# Altium schematic sheet IMX8_eMMC.SchDoc
size 594 x 420 mm; SheetNumber: 12; SheetTotal: 20
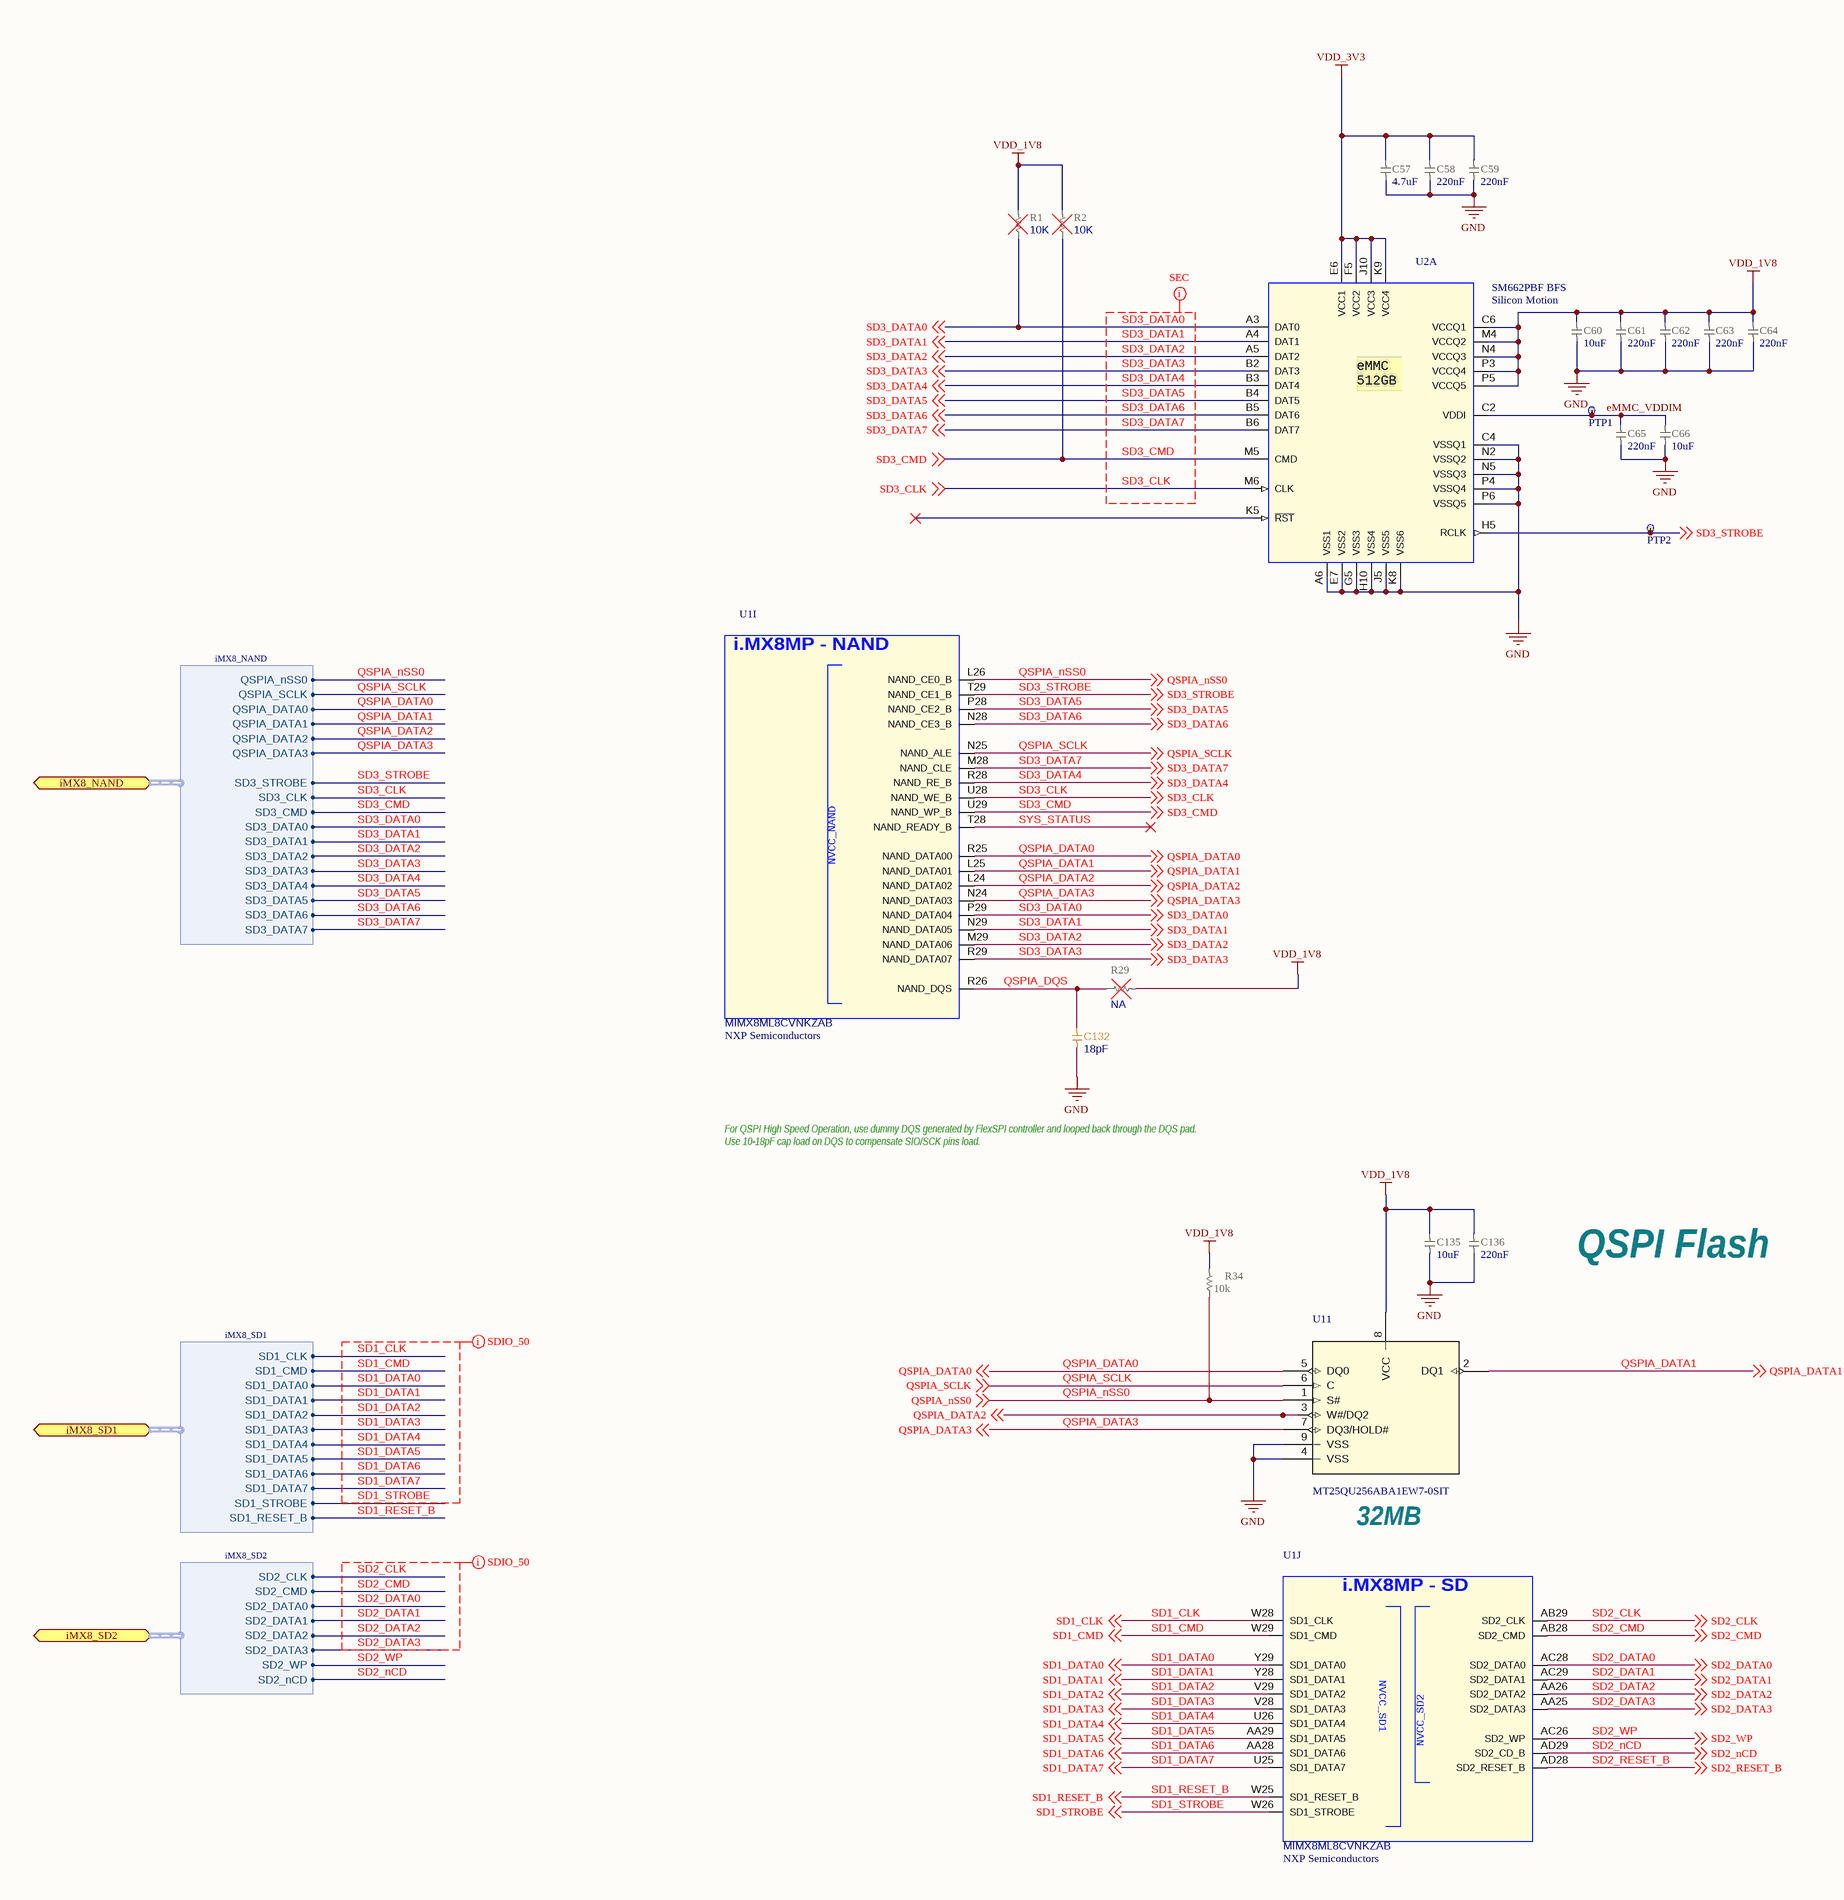
[diagram p0: IMX8_eMMC.SchDoc, left]
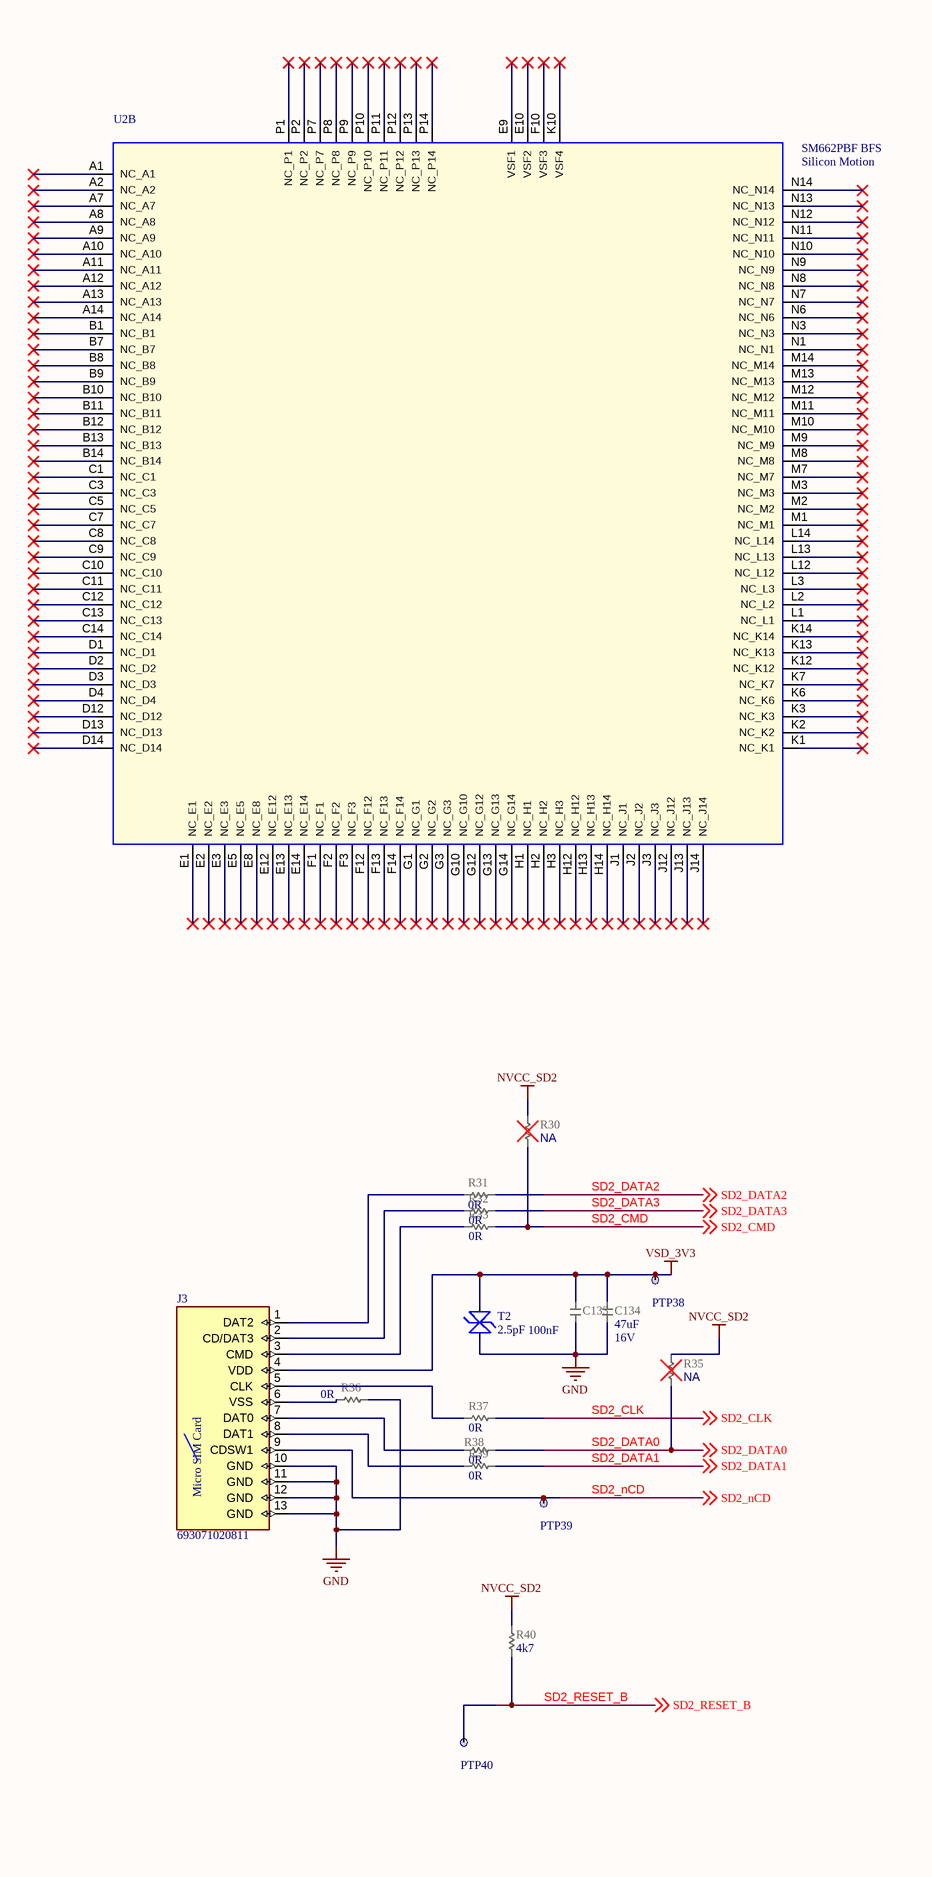
[diagram p1: IMX8_eMMC.SchDoc, right]

## Parts
C57  value 4.7uF  [CAP_0402_H09W07_UN1Q]  (hidden comment: CAP_0402_4u7_10V_X6S)
C58  value 220nF  [CAP_0201_UN1Q]  (hidden comment: CAP_0201_220n_10V_X6S)
C59  value 220nF  [CAP_0201_UN1Q]  (hidden comment: CAP_0201_220n_10V_X6S)
C60  value 10uF  [CAP_0402_H09W07_UN1Q]  (hidden comment: CAP_0402_10u_X6S)
C61  value 220nF  [CAP_0201_UN1Q]  (hidden comment: CAP_0201_220n_10V_X6S)
C62  value 220nF  [CAP_0201_UN1Q]  (hidden comment: CAP_0201_220n_10V_X6S)
C63  value 220nF  [CAP_0201_UN1Q]  (hidden comment: CAP_0201_220n_10V_X6S)
C64  value 220nF  [CAP_0201_UN1Q]  (hidden comment: CAP_0201_220n_10V_X6S)
C65  value 220nF  [CAP_0201_UN1Q]  (hidden comment: CAP_0201_220n_10V_X6S)
C66  value 10uF  [CAP_0402_H09W07_UN1Q]  (hidden comment: CAP_0402_10u_X6S)
C132  value 18pF  [CAP_0201_UN1Q]  (hidden comment: CAP_0201_18p_RF_MATCHING)
C133  value 100nF  [CAP_0201_UN1Q]  (hidden comment: CAP_0201_100n_X7S_16V)
C134  value 47uF  Voltage: 16V  [CAP_1210_UN1Q_1]  (hidden comment: CAP_1210_47uF_16V_X6S)
C135  value 10uF  [CAP_0402_H09W07_UN1Q]  (hidden comment: CAP_0402_10u_X6S)
C136  value 220nF  [CAP_0201_UN1Q]  (hidden comment: CAP_0201_220n_10V_X6S)
J3  693071020811  [693071020811]
PTP1  PTP_0.4mm  [PTP_0.4mm]  (value not drawn)  (no BOM)
PTP2  PTP_0.4mm  [PTP_0.4mm]  (value not drawn)  (no BOM)
PTP38  PTP_0.4mm  [PTP_0.4mm]  (value not drawn)  (no BOM)
PTP39  PTP_0.4mm  [PTP_0.4mm]  (value not drawn)  (no BOM)
PTP40  PTP_0.4mm  [PTP_0.4mm]  (value not drawn)  (no BOM)
R1  value 10K  [RES_0201_UN1Q]  (hidden comment: RES_0201_NA)
R2  value 10K  [RES_0201_UN1Q]  (hidden comment: RES_0201_NA)
R29  value NA  [RES_0201_UN1Q]  (hidden comment: RES_0201_NA)
R30  value NA  [RES_0201_UN1Q]  (hidden comment: RES_0201_NA)
R31  value 0R  [RES_0201_UN1Q]  (hidden comment: RES_0201_0R)
R32  value 0R  [RES_0201_UN1Q]  (hidden comment: RES_0201_0R)
R33  value 0R  [RES_0201_UN1Q]  (hidden comment: RES_0201_0R)
R34  10k  [RES_0201_UN1Q]
R35  value NA  [RES_0201_UN1Q]  (hidden comment: RES_0201_NA)
R36  value 0R  [RES_0201_UN1Q]  (hidden comment: RES_0201_0R)
R37  value 0R  [RES_0201_UN1Q]  (hidden comment: RES_0201_0R)
R38  value 0R  [RES_0201_UN1Q]  (hidden comment: RES_0201_0R)
R39  value 0R  [RES_0201_UN1Q]  (hidden comment: RES_0201_0R)
R40  value 4k7  [RES_0201_UN1Q]  (hidden comment: RES_0201_4k7)
T2  value 2.5pF  [TVS_0201_EZAEG]  (hidden comment: TVS_0201_2.5pF_5V)
U1  Manufacturer: NXP Semiconductors  [BGA548C50P29X29_1500X1500X148]  (hidden comment: MIMX8ML8CVNKZAB)  (parts I,J of 15)
U2  Manufacturer: Silicon Motion  [GA153C50P14X14_1150X1300X120]  (hidden comment: SM662PBF BFS)  (parts A,B of 2)
U11  MT25QU256ABA1EW7-0SIT  [W-PDFN-8MLP8_W7_MRN]

## Ports
iMX8_NAND (bidir, harness iMX8_NAND), iMX8_SD1 (bidir, harness iMX8_SD1), iMX8_SD2 (bidir, harness iMX8_SD2)

## Harnesses
iMX8_SD1: SD1_CLK, SD1_CMD, SD1_DATA0, SD1_DATA1, SD1_DATA2, SD1_DATA3, SD1_DATA4, SD1_DATA5, SD1_DATA6, SD1_DATA7, SD1_RESET_B, SD1_STROBE
iMX8_SD2: SD2_CLK, SD2_CMD, SD2_DATA0, SD2_DATA1, SD2_DATA2, SD2_DATA3, SD2_WP, SD2_nCD
iMX8_NAND: QSPIA_SCLK, QSPIA_DATA0, QSPIA_nSS0, QSPIA_DATA1, QSPIA_DATA2, QSPIA_DATA3, SD3_STROBE, SD3_CLK, SD3_CMD, SD3_DATA0, SD3_DATA1, SD3_DATA2, SD3_DATA3, SD3_DATA4, SD3_DATA5, SD3_DATA6, SD3_DATA7

## Nets
GND: C57.1 C58.1 C59.1 C60.2 C61.1 C62.1 C63.1 C64.1 C65.1 C66.2 C132.1 C133.1 C134.1 C135.2 C136.2 J3.10(GND) J3.11(GND) J3.12(GND) J3.13(GND) R36.2 T2.1 U2.A6(VSS1) U2.C4(VSSQ1) U2.E7(VSS2) U2.G5(VSS3) U2.H10(VSS4) U2.J5(VSS5) U2.K8(VSS6) U2.N2(VSSQ2) U2.N5(VSSQ3) U2.P4(VSSQ4) U2.P6(VSSQ5) U11.4(VSS) U11.9(VSS)
NVCC_SD2: R30.1 R35.1 R40.2
VDD_1V8: C60.1 C61.2 C62.2 C63.2 C64.2 C135.1 C136.1 R1.2 R2.2 R29.2 R34.2 U2.C6(VCCQ1) U2.M4(VCCQ2) U2.N4(VCCQ3) U2.P3(VCCQ4) U2.P5(VCCQ5) U11.8(VCC)
VDD_3V3: C57.2 C58.2 C59.2 U2.E6(VCC1) U2.F5(VCC2) U2.J10(VCC3) U2.K9(VCC4)
VSD_3V3: C133.2 C134.2 J3.4(VDD) PTP38.1(TP) T2.2
eMMC_VDDIM: C65.2 C66.1 PTP1.1(TP) U2.C2(VDDI)
QSPIA_DATA0: U1.R25(NAND_DATA00) U11.5(DQ0) ; off-sheet QSPIA_DATA0, port iMX8_NAND.QSPIA_DATA0
QSPIA_DATA1: U1.L25(NAND_DATA01) U11.2(DQ1) ; off-sheet QSPIA_DATA1, port iMX8_NAND.QSPIA_DATA1
QSPIA_DATA2: U1.L24(NAND_DATA02) U11.3(W#/DQ2) ; off-sheet QSPIA_DATA2, port iMX8_NAND.QSPIA_DATA2
QSPIA_DATA3: U1.N24(NAND_DATA03) U11.7(DQ3/HOLD#) ; off-sheet QSPIA_DATA3, port iMX8_NAND.QSPIA_DATA3
QSPIA_DQS: C132.2 R29.1 U1.R26(NAND_DQS)
QSPIA_nSS0: R34.1 U1.L26(NAND_CE0_B) U11.1(S#) ; off-sheet QSPIA_nSS0, port iMX8_NAND.QSPIA_nSS0
QSPIA_SCLK: U1.N25(NAND_ALE) U11.6(C) ; off-sheet QSPIA_SCLK, port iMX8_NAND.QSPIA_SCLK
SD1_CLK: U1.W28(SD1_CLK) ; off-sheet SD1_CLK, port iMX8_SD1.SD1_CLK
SD1_CMD: U1.W29(SD1_CMD) ; off-sheet SD1_CMD, port iMX8_SD1.SD1_CMD
SD1_DATA0: U1.Y29(SD1_DATA0) ; off-sheet SD1_DATA0, port iMX8_SD1.SD1_DATA0
SD1_DATA1: U1.Y28(SD1_DATA1) ; off-sheet SD1_DATA1, port iMX8_SD1.SD1_DATA1
SD1_DATA2: U1.V29(SD1_DATA2) ; off-sheet SD1_DATA2, port iMX8_SD1.SD1_DATA2
SD1_DATA3: U1.V28(SD1_DATA3) ; off-sheet SD1_DATA3, port iMX8_SD1.SD1_DATA3
SD1_DATA4: U1.U26(SD1_DATA4) ; off-sheet SD1_DATA4, port iMX8_SD1.SD1_DATA4
SD1_DATA5: U1.AA29(SD1_DATA5) ; off-sheet SD1_DATA5, port iMX8_SD1.SD1_DATA5
SD1_DATA6: U1.AA28(SD1_DATA6) ; off-sheet SD1_DATA6, port iMX8_SD1.SD1_DATA6
SD1_DATA7: U1.U25(SD1_DATA7) ; off-sheet SD1_DATA7, port iMX8_SD1.SD1_DATA7
SD1_RESET_B: U1.W25(SD1_RESET_B) ; off-sheet SD1_RESET_B, port iMX8_SD1.SD1_RESET_B
SD1_STROBE: U1.W26(SD1_STROBE) ; off-sheet SD1_STROBE, port iMX8_SD1.SD1_STROBE
SD2_CLK: R37.2 U1.AB29(SD2_CLK) ; off-sheet SD2_CLK, port iMX8_SD2.SD2_CLK
SD2_CMD: R30.2 R33.2 U1.AB28(SD2_CMD) ; off-sheet SD2_CMD, port iMX8_SD2.SD2_CMD
SD2_DATA0: R35.2 R38.2 U1.AC28(SD2_DATA0) ; off-sheet SD2_DATA0, port iMX8_SD2.SD2_DATA0
SD2_DATA1: R39.2 U1.AC29(SD2_DATA1) ; off-sheet SD2_DATA1, port iMX8_SD2.SD2_DATA1
SD2_DATA2: R31.1 U1.AA26(SD2_DATA2) ; off-sheet SD2_DATA2, port iMX8_SD2.SD2_DATA2
SD2_DATA3: R32.2 U1.AA25(SD2_DATA3) ; off-sheet SD2_DATA3, port iMX8_SD2.SD2_DATA3
SD2_nCD: J3.9(CDSW1) PTP39.1(TP) U1.AD29(SD2_CD_B) ; off-sheet SD2_nCD, port iMX8_SD2.SD2_nCD
SD2_RESET_B: PTP40.1(TP) R40.1 U1.AD28(SD2_RESET_B) ; off-sheet SD2_RESET_B
SD2_WP: U1.AC26(SD2_WP) ; off-sheet SD2_WP, port iMX8_SD2.SD2_WP
SD3_CLK: U1.U28(NAND_WE_B) U2.M6(CLK) ; off-sheet SD3_CLK, port iMX8_NAND.SD3_CLK
SD3_CMD: R2.1 U1.U29(NAND_WP_B) U2.M5(CMD) ; off-sheet SD3_CMD, port iMX8_NAND.SD3_CMD
SD3_DATA0: R1.1 U1.P29(NAND_DATA04) U2.A3(DAT0) ; off-sheet SD3_DATA0, port iMX8_NAND.SD3_DATA0
SD3_DATA1: U1.N29(NAND_DATA05) U2.A4(DAT1) ; off-sheet SD3_DATA1, port iMX8_NAND.SD3_DATA1
SD3_DATA2: U1.M29(NAND_DATA06) U2.A5(DAT2) ; off-sheet SD3_DATA2, port iMX8_NAND.SD3_DATA2
SD3_DATA3: U1.R29(NAND_DATA07) U2.B2(DAT3) ; off-sheet SD3_DATA3, port iMX8_NAND.SD3_DATA3
SD3_DATA4: U1.R28(NAND_RE_B) U2.B3(DAT4) ; off-sheet SD3_DATA4, port iMX8_NAND.SD3_DATA4
SD3_DATA5: U1.P28(NAND_CE2_B) U2.B4(DAT5) ; off-sheet SD3_DATA5, port iMX8_NAND.SD3_DATA5
SD3_DATA6: U1.N28(NAND_CE3_B) U2.B5(DAT6) ; off-sheet SD3_DATA6, port iMX8_NAND.SD3_DATA6
SD3_DATA7: U1.M28(NAND_CLE) U2.B6(DAT7) ; off-sheet SD3_DATA7, port iMX8_NAND.SD3_DATA7
SD3_STROBE: PTP2.1(TP) U1.T29(NAND_CE1_B) U2.H5(RCLK) ; off-sheet SD3_STROBE, port iMX8_NAND.SD3_STROBE
SYS_STATUS: U1.T28(NAND_READY_B)
NetJ3_1: J3.1(DAT2) R31.2
NetJ3_2: J3.2(CD/DAT3) R32.1
NetJ3_3: J3.3(CMD) R33.1
NetJ3_5: J3.5(CLK) R37.1
NetJ3_6: J3.6(VSS) R36.1
NetJ3_7: J3.7(DAT0) R38.1
NetJ3_8: J3.8(DAT1) R39.1

Not connected (* = marked no-connect by the designer): U2 A1(NC_A1)* A2(NC_A2)* A7(NC_A7)* A8(NC_A8)* A9(NC_A9)* A10(NC_A10)* A11(NC_A11)* A12(NC_A12)* A13(NC_A13)* A14(NC_A14)* B1(NC_B1)* B7(NC_B7)* B8(NC_B8)* B9(NC_B9)* B10(NC_B10)* B11(NC_B11)* B12(NC_B12)* B13(NC_B13)* B14(NC_B14)* C1(NC_C1)* C3(NC_C3)* C5(NC_C5)* C7(NC_C7)* C8(NC_C8)* C9(NC_C9)* C10(NC_C10)* C11(NC_C11)* C12(NC_C12)* C13(NC_C13)* C14(NC_C14)* D1(NC_D1)* D2(NC_D2)* D3(NC_D3)* D4(NC_D4)* D12(NC_D12)* D13(NC_D13)* D14(NC_D14)* E1(NC_E1)* E2(NC_E2)* E3(NC_E3)* E5(NC_E5)* E8(NC_E8)* E9(VSF1)* E10(VSF2)* E12(NC_E12)* E13(NC_E13)* E14(NC_E14)* F1(NC_F1)* F2(NC_F2)* F3(NC_F3)* F10(VSF3)* F12(NC_F12)* F13(NC_F13)* F14(NC_F14)* G1(NC_G1)* G2(NC_G2)* G3(NC_G3)* G10(NC_G10)* G12(NC_G12)* G13(NC_G13)* G14(NC_G14)* H1(NC_H1)* H2(NC_H2)* H3(NC_H3)* H12(NC_H12)* H13(NC_H13)* H14(NC_H14)* J1(NC_J1)* J2(NC_J2)* J3(NC_J3)* J12(NC_J12)* J13(NC_J13)* J14(NC_J14)* K1(NC_K1)* K2(NC_K2)* K3(NC_K3)* K5(~{RST})* K6(NC_K6)* K7(NC_K7)* K10(VSF4)* K12(NC_K12)* K13(NC_K13)* K14(NC_K14)* L1(NC_L1)* L2(NC_L2)* L3(NC_L3)* L12(NC_L12)* L13(NC_L13)* L14(NC_L14)* M1(NC_M1)* M2(NC_M2)* M3(NC_M3)* M7(NC_M7)* M8(NC_M8)* M9(NC_M9)* M10(NC_M10)* M11(NC_M11)* M12(NC_M12)* M13(NC_M13)* M14(NC_M14)* N1(NC_N1)* N3(NC_N3)* N6(NC_N6)* N7(NC_N7)* N8(NC_N8)* N9(NC_N9)* N10(NC_N10)* N11(NC_N11)* N12(NC_N12)* N13(NC_N13)* N14(NC_N14)* P1(NC_P1)* P2(NC_P2)* P7(NC_P7)* P8(NC_P8)* P9(NC_P9)* P10(NC_P10)* P11(NC_P11)* P12(NC_P12)* P13(NC_P13)* P14(NC_P14)*

## Layout directives
net class SEC: SD3_CLK, SD3_CMD, SD3_DATA0, SD3_DATA1, SD3_DATA2, SD3_DATA3, SD3_DATA4, SD3_DATA5, SD3_DATA6, SD3_DATA7
net class SDIO: SD1_CLK, SD1_CMD, SD1_DATA0, SD1_DATA1, SD1_DATA2, SD1_DATA3, SD1_DATA4, SD1_DATA5, SD1_DATA6, SD1_DATA7, SD1_STROBE, SD2_CLK, SD2_CMD, SD2_DATA0, SD2_DATA1, SD2_DATA2, SD2_DATA3

## Notes on the sheet
- For QSPI High Speed Operation, use dummy DQS generated by FlexSPI controller and looped back through the DQS pad.
  Use 10-18pF cap load on DQS to compensate SIO/SCK pins load.
- QSPI Flash
- (near U11) 32MB
- DWG NO:
- REV:
- THIS DOCUMENT AND THE DATA DISCLOSED HEREIN OR
- HEREWITH IS THE PROPERTY OF ALTIUM LIMITED AND MAY
- BE FREELY DISTRIBUTED IN WHOLE. NO RIGHTS ARE
- RESERVED OR EXPRESS OR IMPLIED WARANTEE GIVEN.
- REVISION
- DESCRIPTION
- DATE
- APPROVED
- ENG:
- APPROVALS
- PROJECT
- DSN:
- CHK:
- REFERENCE DOCUMENTS
- PROJECT REVISION:
- TITLE
- DOCUMENT REVISION:
- DESIGN ITEM:
- BOM:
- FAB DWG:
- PCB DWG:
- ASSY DWG:
- SCALE:
- A2
- SIZE
- CAGE CODE
- FILE NAME
- DWG NO.
- SHEET
- OF
- REV
- (in symbol 693071020811) Micro SIM Card
- (in symbol CMP-001-000983-8, part I) i.MX8MP - NAND
- (in symbol CMP-001-000983-8, part J) i.MX8MP - SD
- (in symbol CMP-001-001175-2, part A) eMMC / 512GB

## Library data of the parts
C57 = CMP-001-000888-12: CAP; Part Number: GRT155C81A475ME13J; Manufacturer: Murata; Sort order: 304; HasBeenBuilt: TBD; Alternative component: Allowed; System: RLC; Voltage: 10V; Temperature characteristics: X6S; Tolerance: +/-10%; ComponentLink2Description: 2_Product page; Package: 0402; Creation date: 26042024; ComponentLink1Description: 1_Datasheet; ComponentLink3Description: 3_X-information; ComponentLink4Description: 4_X-information; Manufacturer Part Number: GRT155C81A475ME13J; Component Type: Capacitor
C58 C59 C61-C65 C136 = CMP-001-000889-11: CAP; Part Number: GRM033C81A224KE01D; Manufacturer: Murata; Temperature characteristics: X6S; Voltage: 10V; Tolerance: +/-20%; Sort order: 302; HasBeenBuilt: TBD; Alternative component: Allowed; System: RLC; Package: 0201; Dimensions WxLxH: 0.35; ComponentLink1Description: 1_Datasheet; ComponentLink2Description: 2_Product page; ComponentLink3Description: 3_X-information; ComponentLink4Description: 4_X-information; Creation date: 26042024; ClassName: SMALL; Manufacturer Part Number: GRM033C81A224KE01D; Component Type: Capacitor
C60 C66 C135 = CMP-001-000883-14: CAP; Part Number: GMC04X6S106M6R3NT; Manufacturer: Cal-Chip Electronics, Inc.; Manufacturer: Cal-Chip Electronics; Voltage: 6.3V; Tolerance: +/-20%; Temperature characteristics: X6S; Sort order: 304; HasBeenBuilt: TBD; Alternative component: Allowed; System: RLC; Package: 0402; ComponentLink1Description: 1_Datasheet; ComponentLink2Description: 2_Product page; ComponentLink3Description: 3_X-information; ComponentLink4Description: 4_X-information; Creation date: 26042024; Manufacturer Part Number: GMC04X6S106M6R3NT; Component Type: Capacitor
C132 = CMP-001-000400-12: CAP_RF_MATCHING; Part Number: GJM0335C1E180JB01; Manufacturer: Murata; Voltage: 25V; Tolerance: +/-2%; Temperature characteristics: C0G; Remark: RF matching, use part number; Sort order: 202; HasBeenBuilt: TBD; System: RLC; Package: 0201; ClassName: SMALL; ComponentLink1Description: 1_Datasheet; ComponentLink2Description: 2_Product page; ComponentLink3Description: 3_X-information; ComponentLink4Description: 4_X-information; Creation date: 20200101; Source: RLC_UN1Q.SchLib; Manufacturer Part Number: GJM0335C1E180JB01; Component Type: Capacitor
C133 = CMP-001-000385-16: CAP; Part Number: GRM033C71C104KE14D; Manufacturer: Murata; Temperature characteristics: X7S; Tolerance: +/-10%; Sort order: 302; HasBeenBuilt: TBD; Alternative component: Allowed; Voltage: 16V; System: RLC; Package: 0201; ClassName: SMALL; ComponentLink1Description: 1_Datasheet; ComponentLink2Description: 2_Product page; ComponentLink3Description: 3_X-information; ComponentLink4Description: 4_X-information; Creation date: 20190101; Source: RLC_UN1Q.SchLib; Manufacturer Part Number: GRM033C71C104KE14D; Component Type: Capacitor
C134 = CMP-001-001071-3: CAP; Part Number: GRM32EC81C476KE15K; Manufacturer: Murata; Temperature characteristics: X6S; Tolerance: ±10%; Sort order: 304; HasBeenBuilt: no; Alternative component: Allowed; System: RLC; Package: 1210; Operating temperature range: -55 ... +105 °C; Dimensions WxLxH: 2.5 x 3.2 x 2.5; ComponentLink1Description: 2_Product_page; ComponentLink2Description: 2_Product page; ComponentLink3Description: 3_X-information; ComponentLink4Description: 4_X-information; Creation date: 20250214; ECCN: EAR99; RoHS: RoHS3; Manufacturer Part Number: GRM32EC81C476KE15K; Component Type: Capacitor
J3 = 693071020811: MF: {'manufacturer': u'W\xfcrth Elektronik'}; Package: None; Price: None; Value: *; MP: 693071020811; Availability: Unavailable
PTP1 PTP2 PTP38-PTP40 = CMP-001-001296-3: Production Testpoint 0.4mm. Flying probe. Use 1mm pitch.; Part Number: PTP 0.4mm; ComponentLink4Description: 4_X-information; ComponentLink1Description: 1_Datasheet; Sort order: -; ClassName: SMALL; System: Test Point; HasBeenBuilt: -; Design Item ID: PTP_0.4mm; ComponentLink3Description: 3_X-information; Creation date: 20240909; ComponentLink2Description: 2_Product page; Component Type: Test Point
R1 R2 R29 R30 R35 = CMP-001-000434-10: Not Assembled - RES; Sort order: 999; HasBeenBuilt: TBD; System: RLC; Package: 0201; ClassName: SMALL; ComponentLink1Description: 1_Datasheet; ComponentLink2Description: 2_Product page; ComponentLink3Description: 3_X-information; ComponentLink4Description: 4_X-information; Creation date: 20190101; Source: RLC_UN1Q.SchLib; Component Type: Resistor
R31-R33 R36-R39 = CMP-001-000429-13: RES; Part Number: RC0201JR-070RL; Manufacturer: YAGEO; Manufacturer: Yageo Group; Tolerance: 5%; Sort order: 322; HasBeenBuilt: TBD; Alternative component: Allowed; System: RLC; Power Rating: 1/20W; Package: 0201; ComponentLink1Description: 1_Datasheet; ComponentLink2Description: 2_Product page; ComponentLink3Description: 3_X-information; ComponentLink4Description: 4_X-information; Creation date: 20190101; ClassName: SMALL; Source: RLC_UN1Q.SchLib; Manufacturer Part Number: RC0201JR-070RL; Component Type: Resistor
R34 = RES_0201_10k: RES; Tolerance: +/-1%; Desc2: resistance_10K_1%_1/20W; Power Rating: 1/20W; Sort order: 322; HasBeenBuilt: TBD; HasBeenChecked: None; System: RLC; Value: 10k; Package: 0201; ClassName: SMALL; ComponentLink1Description: 1_Datasheet; ComponentLink2Description: 2_Product_page; ComponentLink3Description: 3_X-information; ComponentLink4Description: 4_X-information; Creation date: 20190101
R40 = CMP-001-000475-13: RES; Part Number: RC0201FR-074K7L; Manufacturer: YAGEO; Manufacturer: Yageo Group; Power Rating: 1/20W; Sort order: 322; HasBeenBuilt: TBD; Alternative component: Allowed; Tolerance: 1%; System: RLC; Package: 0201; ClassName: SMALL; ComponentLink1Description: 1_Datasheet; ComponentLink2Description: 2_Product page; ComponentLink3Description: 3_X-information; ComponentLink4Description: 4_X-information; Creation date: 20190101; Source: RLC_UN1Q.SchLib; Manufacturer Part Number: RC0201FR-074K7L; Component Type: Resistor
T2 = CMP-001-001100-2: ESD Protection  TVS Diodes SMP Diode 0201 5vdc 2.5pf <12v clamp@1a; Part Number: GG0201052R542P; Manufacturer: KYOCERA AVX; Voltage: 5.0V; Sort order: 402; System: Discrete; Package: 0201; Operating temperature range: -55 ... +125C; ComponentLink1Description: 1_Datasheet; ComponentLink1URL: https://datasheets.kyocera-avx.com/AVX-GiGuard.pdf; ComponentLink2Description: 2_Product page; ComponentLink3Description: 3_X-information; ComponentLink4Description: 4_X-information; Creation date: 20250310; ClassName: SMALL; Manufacturer Part Number: GG0201052R542P; Component Type: ESD & EMI
U1 = CMP-001-000983-8: CPU QUAD CORTEX A53+M4 1.6GHZ BGA548 Industrial; Sort order: 501; System: IC; ComponentLink1Description: 1_Datasheet; ComponentLink1URL: https://www.nxp.com/part/MIMX8ML8CVNKZAB#/; ComponentLink2Description: 2_Product page; ComponentLink3Description: 3_X-information; ComponentLink4Description: 4_X-information; Creation date: 20240524; Dimensions WxLxH: 15 x 15 x 1.33mm; Manufacturer: NXP SEMICONDUCTORS; Operating temperature range: -40... +105 °C; Package: FCBGA548; Part Number: MIMX8ML8CVNKZAB; ClassName: BIG; Source: UUDET_KOMPONENTIT.SchLib; Design Item ID: MIMX8ML8CVNKZAB; Manufacturer Part Number: MIMX8ML8CVNKZAB; Component Type: Processor
U2 = CMP-001-001175-2: MEM NAND FLASH 512GB eMMC 5.1 HS400 2.7-3.6V, 1.8V VCCQ, TFBGA153 Ferri-eMMC Automotive; Manufacturer: Silicon Motion, Inc.; Manufacturer Part Number: SM662PBFBFSS; Sort order: 511; System: IC; ComponentLink1Description: 1_Datasheet; ComponentLink2Description: 2_Product page; ComponentLink2URL: https://www.siliconmotion.com/products/Ferri-eMMC/detail; ComponentLink3Description: 3_Product brief; ComponentLink3URL: https://www.siliconmotion.com/download/DWo5/a/Ferri-eMMC_PB_EN.pdf; ComponentLink4Description: 4_X-information; Creation Date: 20250508; Dimensions WxLxH: 11.5 x 13 x 1.2 mm; Operating temperature range: -40 .... +105 °C; Package: TFBGA-153; Part Number: SM662PBF BFS; Component Type: Memory
U11 = MT25QU256ABA1EW7-0SIT: Description; Manufacturer_Name: Micron; Copyright: Copyright (C) 2025 Ultra Librarian. All rights reserved.; Manufacturer_Part_Number: MT25QU256ABA1EW7-0SIT; RefDes: RefDes; Type: Type